# EAGLE design MegaSineShield (EAGLE 7.7.0)
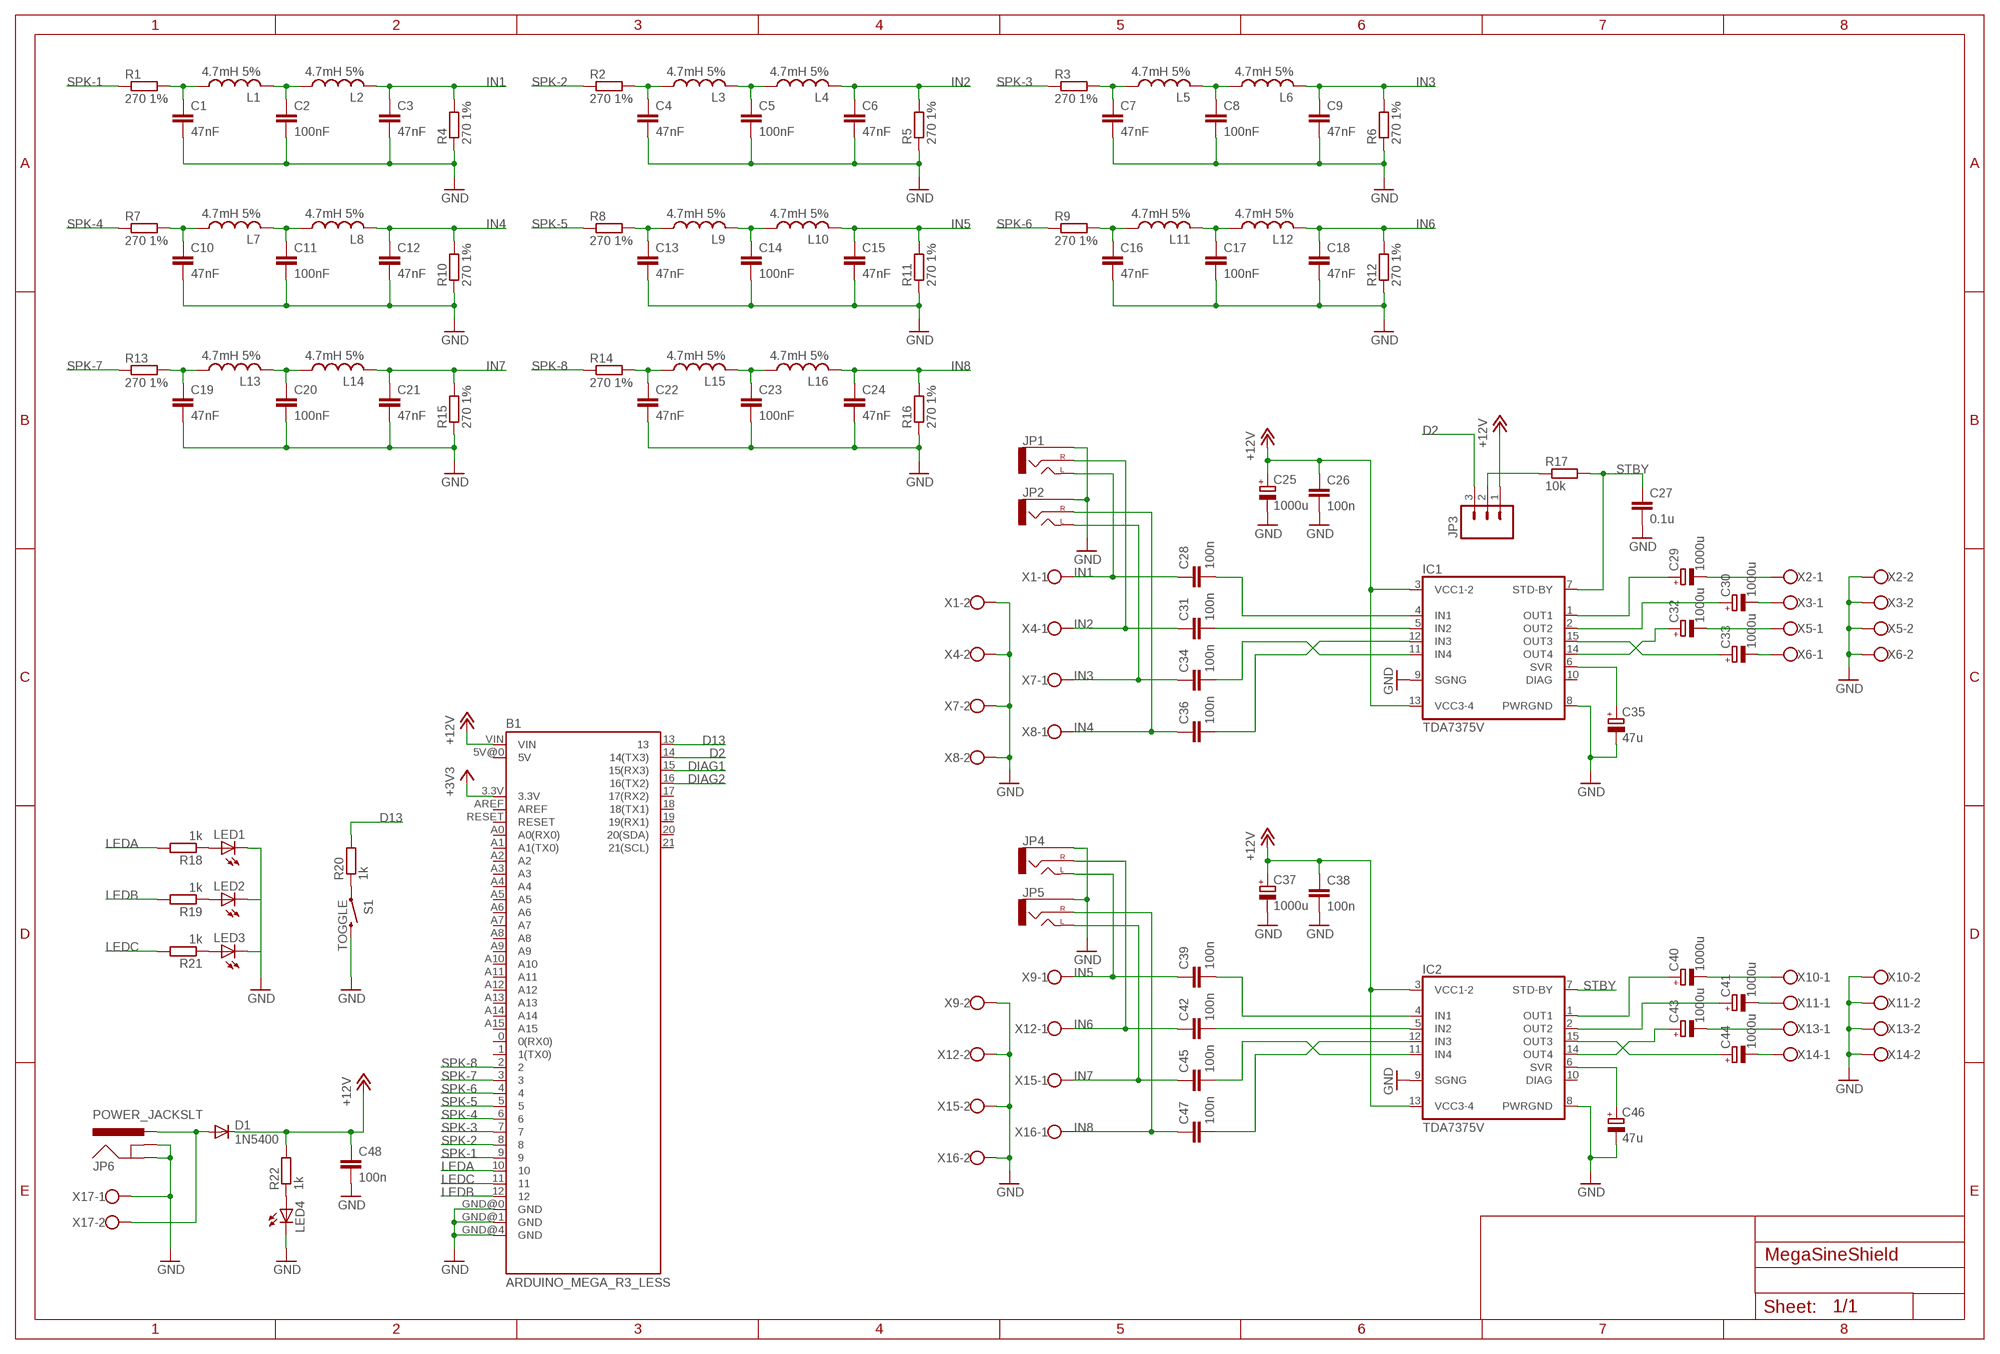
[diagram p0: schematic, sheet 1]

## Parts
B1  ARDUINO_MEGA_R3_LESS  [ARDUINO_MEGA_LESS]
C1  47nF  C-EU025-025X050  [C025-025X050]
C2  100nF  C-EU025-025X050  [C025-025X050]
C3  47nF  C-EU025-025X050  [C025-025X050]
C4  47nF  C-EU025-025X050  [C025-025X050]
C5  100nF  C-EU025-025X050  [C025-025X050]
C6  47nF  C-EU025-025X050  [C025-025X050]
C7  47nF  C-EU025-025X050  [C025-025X050]
C8  100nF  C-EU025-025X050  [C025-025X050]
C9  47nF  C-EU025-025X050  [C025-025X050]
C10  47nF  C-EU025-025X050  [C025-025X050]
C11  100nF  C-EU025-025X050  [C025-025X050]
C12  47nF  C-EU025-025X050  [C025-025X050]
C13  47nF  C-EU025-025X050  [C025-025X050]
C14  100nF  C-EU025-025X050  [C025-025X050]
C15  47nF  C-EU025-025X050  [C025-025X050]
C16  47nF  C-EU025-025X050  [C025-025X050]
C17  100nF  C-EU025-025X050  [C025-025X050]
C18  47nF  C-EU025-025X050  [C025-025X050]
C19  47nF  C-EU025-025X050  [C025-025X050]
C20  100nF  C-EU025-025X050  [C025-025X050]
C21  47nF  C-EU025-025X050  [C025-025X050]
C22  47nF  C-EU025-025X050  [C025-025X050]
C23  100nF  C-EU025-025X050  [C025-025X050]
C24  47nF  C-EU025-025X050  [C025-025X050]
C25  1000u  CPOL-EUE5-10.5  [E5-10,5]
C26  100n  C-EU025-025X050  [C025-025X050]
C27  0.1u  C-EU025-025X050  [C025-025X050]
C28  100n  C-EU025-025X050  [C025-025X050]
C29  1000u  CPOL-EUE5-10.5  [E5-10,5]
C30  1000u  CPOL-EUE5-10.5  [E5-10,5]
C31  100n  C-EU025-025X050  [C025-025X050]
C32  1000u  CPOL-EUE5-10.5  [E5-10,5]
C33  1000u  CPOL-EUE5-10.5  [E5-10,5]
C34  100n  C-EU025-025X050  [C025-025X050]
C35  47u  CPOL-EUE2.5-5  [E2,5-5]
C36  100n  C-EU025-025X050  [C025-025X050]
C37  1000u  CPOL-EUE5-10.5  [E5-10,5]
C38  100n  C-EU025-025X050  [C025-025X050]
C39  100n  C-EU025-025X050  [C025-025X050]
C40  1000u  CPOL-EUE5-10.5  [E5-10,5]
C41  1000u  CPOL-EUE5-10.5  [E5-10,5]
C42  100n  C-EU025-025X050  [C025-025X050]
C43  1000u  CPOL-EUE5-10.5  [E5-10,5]
C44  1000u  CPOL-EUE5-10.5  [E5-10,5]
C45  100n  C-EU025-025X050  [C025-025X050]
C46  47u  CPOL-EUE2.5-5  [E2,5-5]
C47  100n  C-EU025-025X050  [C025-025X050]
C48  100n  C-EU025-025X050  [C025-025X050]
D1  1N5400  [DO201-15]
IC1  TDA7375V  [MULTIWATT-15V]
IC2  TDA7375V  [MULTIWATT-15V]
JP1  AUDIO-JACKPTH  [AUDIO-JACK]
JP2  AUDIO-JACKPTH  [AUDIO-JACK]
JP3  M03LOCK  [1X03_LOCK]
JP4  AUDIO-JACKPTH  [AUDIO-JACK]
JP5  AUDIO-JACKPTH  [AUDIO-JACK]
JP6  POWER_JACKSLT  [POWER_JACK_SLOT]
L1  4.7mH 5%  L-US0207/2V  [0207/2V]
L2  4.7mH 5%  L-US0207/2V  [0207/2V]
L3  4.7mH 5%  L-US0207/2V  [0207/2V]
L4  4.7mH 5%  L-US0207/2V  [0207/2V]
L5  4.7mH 5%  L-US0207/2V  [0207/2V]
L6  4.7mH 5%  L-US0207/2V  [0207/2V]
L7  4.7mH 5%  L-US0207/2V  [0207/2V]
L8  4.7mH 5%  L-US0207/2V  [0207/2V]
L9  4.7mH 5%  L-US0207/2V  [0207/2V]
L10  4.7mH 5%  L-US0207/2V  [0207/2V]
L11  4.7mH 5%  L-US0207/2V  [0207/2V]
L12  4.7mH 5%  L-US0207/2V  [0207/2V]
L13  4.7mH 5%  L-US0207/2V  [0207/2V]
L14  4.7mH 5%  L-US0207/2V  [0207/2V]
L15  4.7mH 5%  L-US0207/2V  [0207/2V]
L16  4.7mH 5%  L-US0207/2V  [0207/2V]
LED1  LED5MM  [LED5MM]
LED2  LED5MM  [LED5MM]
LED3  LED5MM  [LED5MM]
LED4  LED5MM  [LED5MM]
R1  270 1%  R-EU_0207/2V  [0207/2V]
R2  270 1%  R-EU_0207/2V  [0207/2V]
R3  270 1%  R-EU_0207/2V  [0207/2V]
R4  270 1%  R-EU_0207/2V  [0207/2V]
R5  270 1%  R-EU_0207/2V  [0207/2V]
R6  270 1%  R-EU_0207/2V  [0207/2V]
R7  270 1%  R-EU_0207/2V  [0207/2V]
R8  270 1%  R-EU_0207/2V  [0207/2V]
R9  270 1%  R-EU_0207/2V  [0207/2V]
R10  270 1%  R-EU_0207/2V  [0207/2V]
R11  270 1%  R-EU_0207/2V  [0207/2V]
R12  270 1%  R-EU_0207/2V  [0207/2V]
R13  270 1%  R-EU_0207/2V  [0207/2V]
R14  270 1%  R-EU_0207/2V  [0207/2V]
R15  270 1%  R-EU_0207/2V  [0207/2V]
R16  270 1%  R-EU_0207/2V  [0207/2V]
R17  10k  R-EU_0207/2V  [0207/2V]
R18  1k  R-EU_0207/2V  [0207/2V]
R19  1k  R-EU_0207/2V  [0207/2V]
R20  1k  R-EU_0207/2V  [0207/2V]
R21  1k  R-EU_0207/2V  [0207/2V]
R22  1k  R-EU_0207/2V  [0207/2V]
S1  TOGGLE  SWITCH-MOMENTARY-2PTH  [TACTILE-PTH]
X1  W237-102  [W237-102]
X2  W237-102  [W237-102]
X3  W237-102  [W237-102]
X4  W237-102  [W237-102]
X5  W237-102  [W237-102]
X6  W237-102  [W237-102]
X7  W237-102  [W237-102]
X8  W237-102  [W237-102]
X9  W237-102  [W237-102]
X10  W237-102  [W237-102]
X11  W237-102  [W237-102]
X12  W237-102  [W237-102]
X13  W237-102  [W237-102]
X14  W237-102  [W237-102]
X15  W237-102  [W237-102]
X16  W237-102  [W237-102]
X17  W237-102  [W237-102]

## Nets
+3V3: B1.3.3V
+12V: B1.VIN C25.+ C26.1 C37.+ C38.1 C48.1 D1.C IC1.3(VCC1-2) IC1.13(VCC3-4) IC2.3(VCC1-2) IC2.13(VCC3-4) JP3.1 R22.2
D2: B1.14(14(TX3)) JP3.3
D13: B1.13 R20.2
DIAG1: B1.15(15(RX3))
DIAG2: B1.16(16(TX2))
GND: B1.GND@0(GND) B1.GND@1(GND) B1.GND@4(GND) C1.2 C2.2 C3.2 C4.2 C5.2 C6.2 C7.2 C8.2 C9.2 C10.2 C11.2 C12.2 C13.2 C14.2 C15.2 C16.2 C17.2 C18.2 C19.2 C20.2 C21.2 C22.2 C23.2 C24.2 C25.- C26.2 C27.2 C35.- C37.- C38.2 C46.- C48.2 IC1.8(PWRGND) IC1.9(SGNG) IC2.8(PWRGND) IC2.9(SGNG) JP1.SLEEVE JP2.SLEEVE JP4.SLEEVE JP5.SLEEVE JP6.GND@1(GNDBREAK) JP6.GND@2(GND) LED1.K(C) LED2.K(C) LED3.K(C) LED4.K(C) R4.1 R5.1 R6.1 R10.1 R11.1 R12.1 R15.1 R16.1 S1.3 X1.2 X2.2 X3.2 X4.2 X5.2 X6.2 X7.2 X8.2 X9.2 X10.2 X11.2 X12.2 X13.2 X14.2 X15.2 X16.2 X17.1
IN1: C3.1 C28.1 JP1.TIP(LEFT) L2.2 R4.2 X1.1
IN2: C6.1 C31.1 JP1.RING(RIGHT) L4.2 R5.2 X4.1
IN3: C9.1 C34.1 JP2.TIP(LEFT) L6.2 R6.2 X7.1
IN4: C12.1 C36.1 JP2.RING(RIGHT) L8.2 R10.2 X8.1
IN5: C15.1 C39.1 JP4.TIP(LEFT) L10.2 R11.2 X9.1
IN6: C18.1 C42.1 JP4.RING(RIGHT) L12.2 R12.2 X12.1
IN7: C21.1 C45.1 JP5.TIP(LEFT) L14.2 R15.2 X15.1
IN8: C24.1 C47.1 JP5.RING(RIGHT) L16.2 R16.2 X16.1
LEDA: B1.10 R18.2
LEDB: B1.12 R19.2
LEDC: B1.11 R21.2
N$1: C44.+ IC2.15(OUT3)
N$2: C32.+ IC1.14(OUT4)
N$3: C30.+ IC1.2(OUT2)
N$4: C29.+ IC1.1(OUT1)
N$9: C28.2 IC1.4(IN1)
N$10: C31.2 IC1.5(IN2)
N$11: C1.1 L1.1 R1.2
N$12: C36.2 IC1.12(IN3)
N$13: C35.+ IC1.6(SVR)
N$14: JP3.2 R17.1
N$15: C29.- X2.1
N$16: C30.- X3.1
N$17: C32.- X5.1
N$18: C33.- X6.1
N$19: LED4.A R22.1
N$24: C39.2 IC2.4(IN1)
N$25: C42.2 IC2.5(IN2)
N$26: C45.2 IC2.11(IN4)
N$27: C47.2 IC2.12(IN3)
N$28: C46.+ IC2.6(SVR)
N$29: C33.+ IC1.15(OUT3)
N$30: C43.+ IC2.14(OUT4)
N$31: C41.+ IC2.2(OUT2)
N$32: C40.+ IC2.1(OUT1)
N$33: C40.- X10.1
N$34: C41.- X11.1
N$35: C43.- X13.1
N$36: C44.- X14.1
N$37: LED1.A R18.1
N$38: LED2.A R19.1
N$39: R20.1 S1.1
N$41: LED3.A R21.1
N$45: D1.A JP6.PWR X17.2
N$46: C34.2 IC1.11(IN4)
N$47: C2.1 L1.2 L2.1
N$50: C10.1 L7.1 R7.2
N$51: C11.1 L7.2 L8.1
N$52: C19.1 L13.1 R13.2
N$53: C20.1 L13.2 L14.1
N$54: C22.1 L15.1 R14.2
N$55: C23.1 L15.2 L16.1
N$56: C4.1 L3.1 R2.2
N$57: C5.1 L3.2 L4.1
N$58: C13.1 L9.1 R8.2
N$59: C14.1 L9.2 L10.1
N$60: C7.1 L5.1 R3.2
N$61: C8.1 L5.2 L6.1
N$62: C16.1 L11.1 R9.2
N$63: C17.1 L11.2 L12.1
SPK-1: B1.9 R1.1
SPK-2: B1.8 R2.1
SPK-3: B1.7 R3.1
SPK-4: B1.6 R7.1
SPK-5: B1.5 R8.1
SPK-6: B1.4 R9.1
SPK-7: B1.3 R13.1
SPK-8: B1.2 R14.1
STBY: C27.1 IC1.7(STD-BY) IC2.7(STD-BY) R17.2
Unconnected: B1.0(0(RX0)) B1.1(1(TX0)) B1.5V@0(5V) B1.17(17(RX2)) B1.18(18(TX1)) B1.19(19(RX1)) B1.20(20(SDA)) B1.21(21(SCL)) B1.A0(A0(RX0)) B1.A1(A1(TX0)) B1.A2 B1.A3 B1.A4 B1.A5 B1.A6 B1.A7 B1.A8 B1.A9 B1.A10 B1.A11 B1.A12 B1.A13 B1.A14 B1.A15 B1.AREF B1.RESET IC1.10(DIAG) IC2.10(DIAG)

## Library data of the parts
B1 = SparkFun-Boards:ARDUINO_MEGA_R3_LESS
C1-C24 C26-C28 C31 C34 C36 C38 C39 C42 C45 C47 C48 = rcl:C-EU: CAPACITOR, European symbol
C25 C29 C30 C32 C33 C35 C37 C40 C41 C43 C44 C46 = rcl:CPOL-EU: POLARIZED CAPACITOR, European symbol
D1 = diode:1N5400: DIODE standard rectifier, 3 A, 50 V (Motorola)
IC1 IC2 = st-tda7375:TDA7375
JP1 JP2 JP4 JP5 = SparkFun-Connectors:AUDIO-JACK: 3.5mm Audio Jack Simple 3.5mm common PCB mount audio jack. Variant PTH is our storefront SKU PRT-08032
JP3 = SparkFun-Connectors:M03: Header 3 Standard 3-pin 0.1" header. Use with straight break away headers (SKU : PRT-00116), right angle break away headers (PRT-00553), swiss pins (PRT-00743), machine pins (PRT-00117), and female headers (PRT-00115). Molex polarized connector foot print use with SKU : PRT-08232 with associated crimp pins and housings.
JP6 = SparkFun-Connectors:POWER_JACK: Power Jack This is the standard 5.5mm barrel jack for power. The PTH is the most common, proven, reliable, footprint. The Slot footprint only works if the mill layer is transmitted to the PCB fab house so be warned. Mating wall wart : TOL-00298 (and others); PROD_ID: PRT-00119
L1-L16 = rcl:L-US: INDUCTOR, American symbol
LED1-LED4 = adafruit:LED: LED OSRAM: - CHIPLED LG R971, LG N971, LY N971, LG Q971, LY Q971, LO R971, LY R971 LH N974, LH R974 LS Q976, LO Q976, LY Q976 LO Q996 - Hyper CHIPLED LW Q18S LB Q993, LB Q99A, LB R99A - SideLED LS A670, LO A670, LY A670, LG A670, LP A670 LB A673, LV A673, LT A673, LW A673 LH A674 LY A675 LS A676, LA A676, LO A676, LY A676, LW A676 LS A679, LY A679, LG A679 - Hyper Micro SIDELED® LS Y876, LA Y876, LO Y876, LY Y876 LT Y87S - SmartLED LW L88C, LW L88S LB L89C, LB L89S, LG L890 LS L89K, LO L89K, LY L89K LS L896, LA L896, LO L896, LY L896 - TOPLED LS T670, LO T670, LY T670, LG T670, LP T670 LSG T670, LSP T670, LSY T670, LOP T670, LYG T670 LG T671, LOG T671, LSG T671 LB T673, LV T673, LT T673, LW T673 LH T674 LS T676, LA T676, LO T676, LY T676, LB T676, LH T676, LSB T676, LW T676 LB T67C, LV T67C, LT T67C, LS T67K, LO T67K, LY T67K, LW E67C LS E67B, LA E67B, LO E67B, LY E67B, LB E67C, LV E67C, LT E67C LW T67C LS T679, LY T679, LG T679 LS T770, LO T770, LY T770, LG T770, LP T770 LB T773, LV T773, LT T773, LW T773 LH T774 LS E675, LA E675, LY E675, LS T675 LS T776, LA T776, LO T776, LY T776, LB T776 LHGB T686 LT T68C, LB T68C - Hyper Mini TOPLED® LB M676 - Mini TOPLED Santana® LG M470 LS M47K, LO M47K, LY M47K Source: http://www.osram.convergy.de/
R1-R22 = rcl:R-EU_: RESISTOR, European symbol
S1 = SparkFun-Electromechanical:SWITCH-MOMENTARY-2: Various NO switches- pushbuttons, reed, etc; PROD_ID: SWCH-08441
X1-X17 = con-wago-500:W237-102: WAGO SCREW CLAMP; MPN: 237-102; OC_FARNELL: unknown; OC_NEWARK: 70K9898

## Board
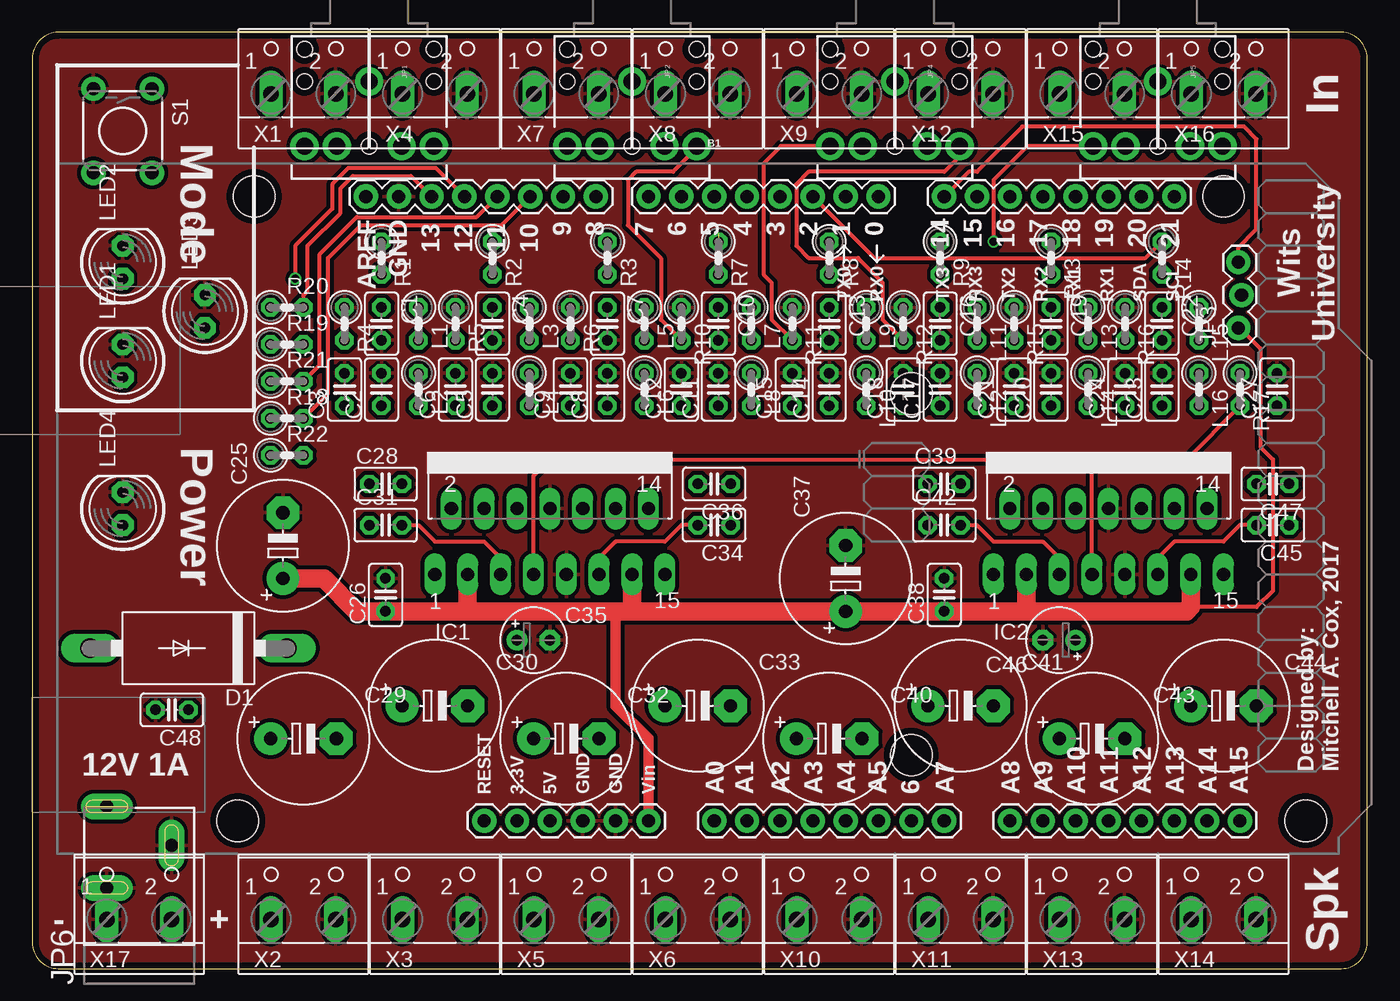
[diagram p1: board, top side]
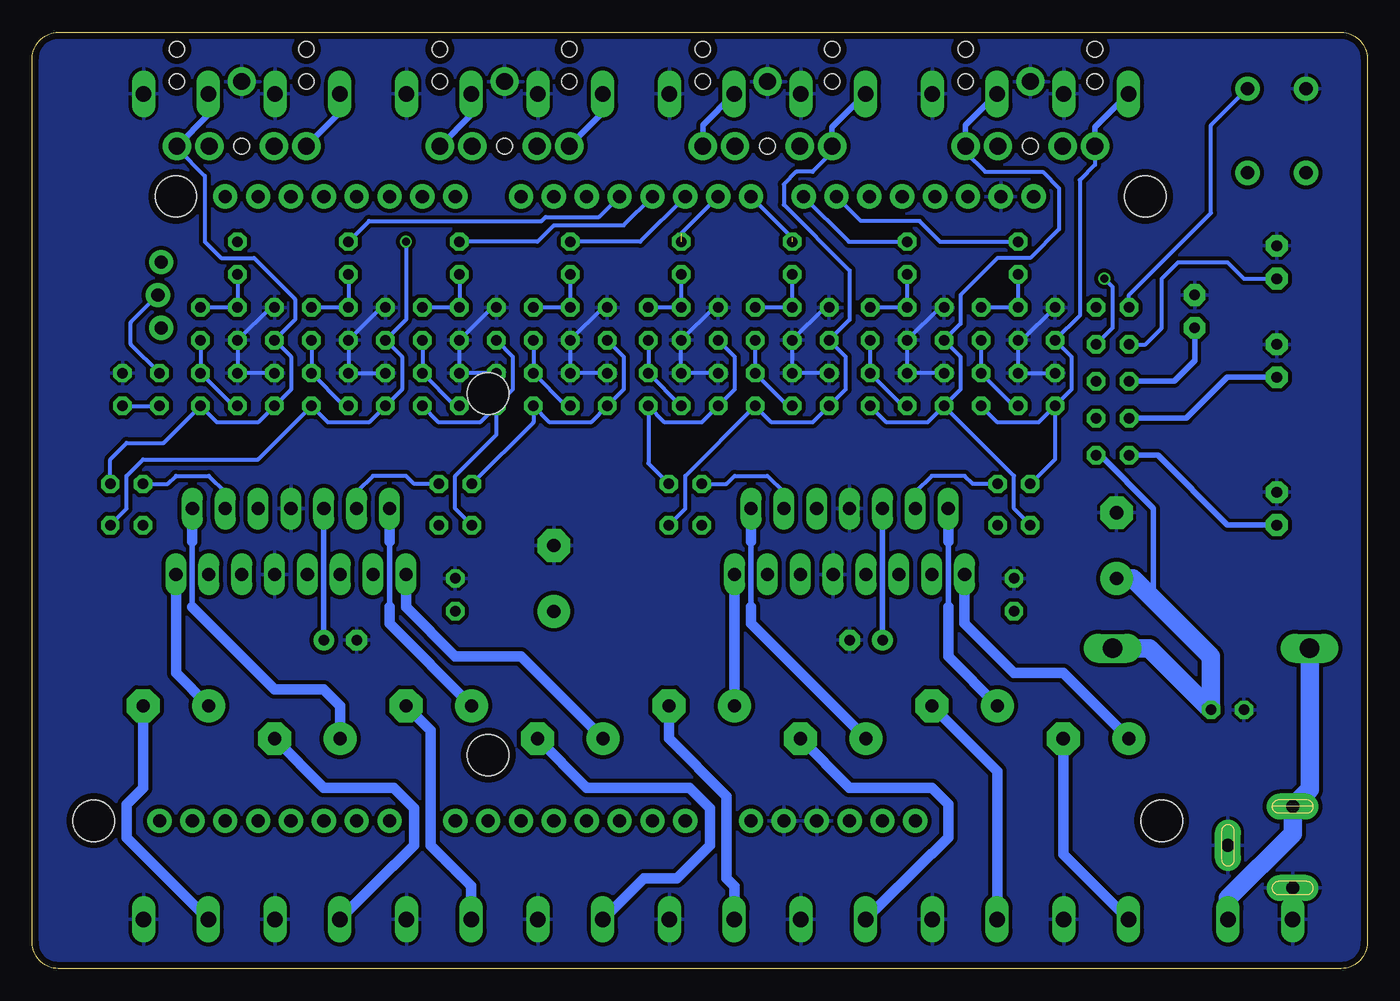
[diagram p2: board, bottom side, seen from below]

Size 103.17 x 72.38 mm. Coordinates in mm from the lower left corner, seen from the top.
Outline: 101.17,72.38 2,72.38 arc90 0,70.38 0,2 arc90 2,0 101.17,0 arc90 103.17,2 103.17,70.38 arc90 101.17,72.38
Copper layers (1*16): Top 0.035mm / dielectric 1.6mm / Bottom 0.035mm
Design rules "Elecrow_2-layer_PCB_eagle_rule *": minimum track width 6mil, minimum drill 12mil, track to track 12mil, track to pad 12mil, pad to pad 12mil, via to via 12mil, smd to smd 0mil, copper to edge 20mil, drill to drill 10mil, minimum pad ring 12mil, minimum via ring 6mil, stop-mask expansion 0mil, vias tented up to drill 100mil, thermal gap 10mil

### Footprints (pad centres in the part's own frame; a part is rotated, then mirrored left to right if it is on the bottom)
ARDUINO_MEGA_LESS = drill 1.016 pad 1.88: 0 13.97,24.13; 1 11.43,24.13; 2 8.89,24.13; 3 6.35,24.13; 3.3V -13.97,-24.13; 4 3.81,24.13; 5 1.27,24.13; 5V@0 -11.43,-24.13; 6 -1.27,24.13; 7 -3.81,24.13; 8 -7.874,24.13; 9 -10.414,24.13; 10 -12.954,24.13; 11 -15.494,24.13; 12 -18.034,24.13; 13 -20.574,24.13; 14 19.05,24.13; 15 21.59,24.13; 16 24.13,24.13; 17 26.67,24.13; 18 29.21,24.13; 19 31.75,24.13; 20 34.29,24.13; 21 36.83,24.13; A0 1.27,-24.13; A1 3.81,-24.13; A2 6.35,-24.13; A3 8.89,-24.13; A4 11.43,-24.13; A5 13.97,-24.13; A6 16.51,-24.13; A7 19.05,-24.13; A8 24.13,-24.13; A9 26.67,-24.13; A10 29.21,-24.13; A11 31.75,-24.13; A12 34.29,-24.13; A13 36.83,-24.13; A14 39.37,-24.13; A15 41.91,-24.13; AREF -25.654,24.13; GND@0 -8.89,-24.13; GND@1 -6.35,-24.13; GND@4 -23.114,24.13; RESET -16.51,-24.13; VIN -3.81,-24.13 | hole 3.2: -34.29,24.13; -35.56,-24.13; 16.51,8.89; 16.51,-19.05; 40.64,24.13; 46.99,-24.13
C025-025X050 = drill 0.813 octagon: 1 -1.27,0; 2 1.27,0
E5-10,5 = drill 1.016 pad 2.54: + -2.54,0 | drill 1.016 pad 2.54 octagon: - 2.54,0
E2,5-5 = drill 0.813 pad 1.6: + -1.27,0 | drill 0.813 pad 1.6 octagon: - 1.27,0
DO201-15 = drill 1.499 long: A 7.62,0; C -7.62,0
MULTIWATT-15V = drill 1.016 long: 1 -8.89,-7.62; 2 -7.62,-2.54; 3 -6.35,-7.62; 4 -5.08,-2.54; 5 -3.81,-7.62; 6 -2.54,-2.54; 7 -1.27,-7.62; 8 0,-2.54; 9 1.27,-7.62; 10 2.54,-2.54; 11 3.81,-7.62; 12 5.08,-2.54; 13 6.35,-7.62; 14 7.62,-2.54; 15 8.89,-7.62
AUDIO-JACK = drill 1.3 pad 2.184: RING 5,5; RSH 5,2.5; SLEEVE 0,0; TIP 5,-5; TSH 5,-2.5 | hole 1.2: 0,5; -2.5,5; -2.5,-5; 0,-5; 5,0
1X03_LOCK = drill 1.016 pad 1.88: 1 0,0.127; 2 2.54,-0.127; 3 5.08,0.127
POWER_JACK_SLOT = drill 1 pad 2 long: GND@1 2.58,7.5; GND@2 7.58,10.8; PWR 2.58,13.8
0207/2V = drill 0.813 octagon: 1 -1.27,0; 2 1.27,0
LED5MM = drill 0.813 pad 1.676 octagon: A -1.27,0; K 1.27,0
TACTILE-PTH = drill 1.016 pad 1.88: 1 -3.251,2.261; 2 3.251,2.261; 3 -3.251,-2.261; 4 3.251,-2.261
W237-102 = drill 1.194 long: 1 -2.5,-1.27; 2 2.5,-1.27

### Placement (x,y rotation side)
B1  51.44,35.56 0 top
C1  26.99,49.85 270 top
C2  26.99,44.77 90 top
C3  24.13,44.77 90 top
C4  35.56,49.85 270 top
C5  35.56,44.77 90 top
C6  32.7,44.77 90 top
C7  44.45,49.85 270 top
C8  44.45,44.77 90 top
C9  41.59,44.77 90 top
C10  53.02,49.85 270 top
C11  53.02,44.77 90 top
C12  50.16,44.77 90 top
C13  61.59,49.85 270 top
C14  61.59,44.77 90 top
C15  58.74,44.77 90 top
C16  70.17,49.85 270 top
C17  70.17,44.77 90 top
C18  67.31,44.77 90 top
C19  78.74,49.85 270 top
C20  78.74,44.77 90 top
C21  75.88,44.77 90 top
C22  87.31,49.85 270 top
C23  87.31,44.77 90 top
C24  84.45,44.77 90 top
C25  19.37,32.7 90 top
C26  27.3,28.89 90 top
C27  96.2,44.77 90 top
C28  27.3,37.47 0 top
C29  20.96,17.78 0 top
C30  31.12,20.32 0 top
C31  27.3,34.29 0 top
C32  41.27,17.78 0 top
C33  51.44,20.32 0 top
C34  52.7,34.29 180 top
C35  38.73,25.4 0 top
C36  52.7,37.47 180 top
C37  62.87,30.16 90 top
C38  70.48,28.89 90 top
C39  70.48,37.47 0 top
C40  61.59,17.78 0 top
C41  71.75,20.32 0 top
C42  70.48,34.29 0 top
C43  81.92,17.78 0 top
C44  92.08,20.32 0 top
C45  95.89,34.29 180 top
C46  79.38,25.4 180 top
C47  95.89,37.47 180 top
C48  10.79,20 180 top
D1  12.06,24.77 180 top
IC1  40.01,38.1 0 top
IC2  83.19,38.1 0 top
JP1  26.04,68.58 270 top
JP2  46.36,68.58 270 top
JP3  93.34,49.53 90 top
JP4  66.67,68.58 270 top
JP5  87,68.58 270 top
JP6  3.17,-1.27 0 top
L1  29.85,49.85 270 top
L2  29.85,44.77 270 top
L3  38.42,49.85 270 top
L4  38.42,44.77 270 top
L5  47.31,49.85 270 top
L6  47.31,44.77 270 top
L7  55.56,49.85 270 top
L8  55.56,44.77 270 top
L9  64.45,49.85 270 top
L10  64.45,44.77 270 top
L11  73.03,49.85 270 top
L12  73.03,44.77 270 top
L13  81.6,49.85 270 top
L14  81.6,44.77 270 top
L15  90.17,49.85 270 top
L16  90.17,44.77 270 top
LED1  6.99,46.99 90 top
LED2  6.99,54.61 90 top
LED3  13.33,50.8 90 top
LED4  6.99,35.56 90 top
R1  26.99,54.93 270 top
R2  35.56,54.93 270 top
R3  44.45,54.93 270 top
R4  24.13,49.85 270 top
R5  32.7,49.85 270 top
R6  41.59,49.85 270 top
R7  53.02,54.93 270 top
R8  61.59,54.93 270 top
R9  70.17,54.93 270 top
R10  50.16,49.85 270 top
R11  58.74,49.85 270 top
R12  67.31,49.85 270 top
R13  78.74,54.93 270 top
R14  87.31,54.93 270 top
R15  75.88,49.85 270 top
R16  84.45,49.85 270 top
R17  93.34,44.77 270 top
R18  19.69,42.55 0 top
R19  19.69,48.26 0 top
R20  19.69,51.12 0 top
R21  19.69,45.4 0 top
R22  19.69,39.69 0 top
S1  6.99,64.77 270 top
X1  20.96,68.9 0 top
X2  20.96,5.08 0 top
X3  31.12,5.08 0 top
X4  31.12,68.9 0 top
X5  41.27,5.08 0 top
X6  51.44,5.08 0 top
X7  41.27,68.9 0 top
X8  51.44,68.9 0 top
X9  61.59,68.9 0 top
X10  61.59,5.08 0 top
X11  71.75,5.08 0 top
X12  71.75,68.9 0 top
X13  81.92,5.08 0 top
X14  92.08,5.08 0 top
X15  81.92,68.9 0 top
X16  92.08,68.9 0 top
X17  8.25,5.08 0 top

### Tracks (layer width: path | path; a pad name or v marks a point on that pad's centre or on a via)
+12V
  Top 0.305: JP3.1 93.34,49.53 94.93,47.94 94.93,40.32 95.89,39.37 95.89,29.21 94.61,27.94 89.53,27.94
  Top 0.813: B1.VIN 47.62,17.78 45.09,20.32 45.09,27.62
  Top 1.422: 33.66,27.62 C26.1 25.08,27.62 22.54,30.16 C25.+ | 33.66,27.62 45.09,27.62 46.36,27.62 | 46.36,27.62 IC1.13 | IC1.3 33.66,27.62 | 46.36,27.62 C37.+ C38.1 76.84,27.62 | IC2.13 89.53,27.94 89.22,27.62 76.84,27.62 | IC2.3 76.84,27.62
  Bottom 0.406: R22.2 20.64,39.69 16.51,35.56 16.51,28.89 16.67,28.73
  Bottom 1.422: C25.+ 18.1,30.16 16.67,28.73 12.06,24.13 C48.1 16.83,24.77 D1.C
D2
  Top 0.305: JP3.3 93.22,55.75 94.61,57.15 94.61,64.14 93.66,65.09 76.52,65.09 73.03,61.59 72.39,61.59 B1.14
D13
  Top 0.305: R20.2 20.96,52.07 21.27,52.39 21.27,55.88 23.81,58.42 23.81,60.33 24.77,61.28 29.27,61.28 B1.13
GND
  Bottom 0.305: C3.2 C2.2 C1.2 26.67,48.58 R4.1 | C6.2 C5.2 C4.2 33.02,51.12 R5.1 | C9.2 C8.2 C7.2 41.91,51.12 R6.1 | C12.2 C11.2 C10.2 50.48,51.12 R10.1 | R11.1 59.05,51.12 C13.2 C14.2 C15.2 | C18.2 C17.2 C16.2 67.63,51.12 R12.1 | C21.2 C20.2 C19.2 76.2,51.12 R15.1 | C24.2 C23.2 C22.2 84.77,51.12 R16.1
  Bottom 1.422: X17.1 JP6.GND@1
  pour Bottom: 0,72.39 103.5,72.39 103.5,-1.27 0,0
  pour Top: -0.64,72.39 103.5,72.39 103.5,0 -0.64,-1.27
IN1
  Bottom 0.305: C3.1 22.86,44.77 22.86,47.31 R4.2 22.23,50.48 22.23,60.96 21.04,62.15 JP1.TIP | C3.1 25.4,42.23 28.58,42.23 L2.2 | C3.1 24.13,39.37 C28.1
  Bottom 0.406: JP1.TIP 21.04,65.05 X1.1
IN2
  Bottom 0.305: C6.1 31.43,44.77 31.43,47.31 R5.2 31.43,49.85 31.43,52.07 28.58,54.93 26.04,54.93 23.81,57.15 23.81,60.33 25.08,61.59 29.53,61.59 31.04,63.1 JP1.RING | C6.1 33.97,42.23 37.15,42.23 L4.2 | C31.1 27.3,35.56 27.3,38.1 C6.1
  Bottom 0.406: JP1.RING 31.04,65.21 X4.1
IN3
  Bottom 0.305: C34.1 52.7,35.56 52.7,38.1 L6.2 46.04,42.23 42.86,42.23 C9.1 40.32,44.77 40.32,47.31 R6.2 40.01,50.16 40.01,53.98 45.09,59.05 45.09,60.64 44.13,61.59 42.86,61.59 41.36,63.1 JP2.TIP
  Bottom 0.406: JP2.TIP 41.36,65.05 X7.1
IN4
  Top 0.305: JP2.RING 51.36,63.42 49.53,61.59 46.67,61.59 46.04,60.96 46.04,57.47 48.58,54.93 48.58,50.16 R10.2
  Bottom 0.305: R10.2 48.9,47.31 48.9,44.77 C12.1 51.44,42.23 54.29,42.23 L8.2 55.56,39.05 C36.1
  Bottom 0.406: JP2.RING 51.36,65.21 X8.1
IN5
  Top 0.305: JP4.TIP 57.87,63.58 56.52,62.23 56.52,53.66 57.15,53.02 57.15,50.16 R11.2
  Bottom 0.305: R11.2 57.47,47.31 57.47,44.77 C15.1 60.01,42.23 63.18,42.23 L10.2 64.45,42.23 C39.1
  Bottom 0.406: X9.1 59.09,66.16 JP4.TIP
IN6
  Top 0.305: JP4.RING 71.67,62.78 70.48,61.59 60.01,61.59 59.05,60.64 59.05,55.88 60.01,54.93 63.82,54.93 65.72,53.02 65.72,50.16 R12.2
  Bottom 0.305: R12.2 66.04,47.31 66.04,44.77 C18.1 | C18.1 68.58,42.23 71.75,42.23 L12.2 | C42.1 70.48,35.56 70.48,38.1 67.31,41.27 C18.1
  Bottom 0.406: X12.1 69.25,66 JP4.RING
IN7  (via drill 0.6)
  Top 0.305: JP5.TIP 76.92,63.58 74.3,60.96 v74.3,56.2
  Bottom 0.305: C45.1 95.89,35.56 95.89,38.1 94.61,39.37 85.72,39.37 L14.2 80.33,42.23 77.15,42.23 C21.1 74.61,44.77 74.61,47.31 R15.2 74.3,50.16 v74.3,56.2
  Bottom 0.406: X15.1 79.42,66.16 JP5.TIP
IN8
  Bottom 0.305: C47.1 97.16,39.37 95.89,40.64 93.03,40.64 L16.2 88.9,42.23 85.72,42.23 C24.1 83.19,44.77 83.19,47.31 R16.2 82.87,50.16 82.87,51.75 86.04,54.93 88.58,54.93 89.85,56.2 89.85,61.28 92,63.42 JP5.RING
  Bottom 0.406: X16.1 89.58,66 JP5.RING
LEDA
  Top 0.305: R18.2 22.86,44.45 22.86,54.93 25.4,57.47 36.26,57.47 B1.10
LEDB  (via drill 0.6)
  Top 0.305: B1.12 31.18,61.91 24.45,61.91 23.18,60.64 23.18,58.74 20.32,55.88 v20.32,53.34
  Bottom 0.305: R19.2 19.69,49.53 19.69,52.7 v20.32,53.34
LEDC
  Top 0.305: B1.11 34.35,58.1 25.08,58.1 22.23,55.24 22.23,46.67 R21.2
N$1
  Bottom 0.813: IC2.15 92.08,22.86 C44.+
N$2
  Bottom 0.406: 47.62,33.02 47.62,27.94
  Bottom 0.813: IC1.14 47.62,33.02 | 47.62,27.94 47.62,26.67 C32.+
N$3
  Bottom 0.406: 32.38,33.02 32.38,27.94
  Bottom 0.813: IC1.2 32.38,33.02 | C30.+ 32.38,24.13 32.38,27.94
N$4
  Bottom 0.813: IC1.1 31.12,26.67 27.3,22.86 23.5,22.86 C29.+
N$9
  Bottom 0.305: C28.2 30.48,37.47 31.12,38.1 33.66,38.1 34.93,36.83 IC1.4
N$10
  Top 0.305: C31.2 29.85,34.29 31.12,33.02 34.93,33.02 36.2,31.75 IC1.5
N$11
  Bottom 0.305: R1.2 C1.1 L1.1
N$12
  Bottom 0.305: C36.2 49.53,37.47 48.9,38.1 46.36,38.1 45.09,36.83 IC1.12
N$13
  Bottom 0.406: IC1.6 C35.+
N$14
  Bottom 0.305: R17.1 95.57,48.26 95.57,49.97 JP3.2
N$15
  Bottom 0.813: C29.- 23.5,8.85 X2.1
N$16  (via drill 0.6)
  Top 0.61: v28.58,3.85 X3.1
  Bottom 0.813: v28.58,3.85 28.58,15.24 C30.-
N$17
  Bottom 0.813: C32.- 40.01,13.97 33.66,13.97 32.38,12.7 32.38,10.16 33.66,8.89 33.7,8.89 X5.1
N$18
  Bottom 0.813: C33.- 53.98,17.78 49.53,13.34 49.53,6.99 48.9,6.35 48.9,3.85 X6.1
N$19
  Bottom 0.406: R22.1 16.19,39.69 10.79,34.29 LED4.A
N$24
  Bottom 0.305: C39.2 73.66,37.47 74.3,38.1 76.84,38.1 78.11,36.83 IC2.4
N$25
  Top 0.305: C42.2 73.03,34.29 74.3,33.02 78.11,33.02 79.38,31.75 IC2.5
N$26
  Top 0.305: C45.2 93.34,34.29 92.08,33.02 88.27,33.02 87,31.75 IC2.11
N$27
  Bottom 0.305: C47.2 92.71,37.47 92.08,38.1 89.53,38.1 88.27,36.83 IC2.12
N$28
  Bottom 0.406: IC2.6 C46.+
N$29
  Bottom 0.813: IC1.15 C33.+
N$30
  Bottom 0.406: 90.81,33.02 90.81,27.94
  Bottom 0.813: IC2.14 90.81,33.02 | 90.81,27.94 84.45,21.59 80.64,21.59 79.38,20.32 C43.+
N$31
  Bottom 0.406: 75.56,33.02 75.56,27.94
  Bottom 0.813: IC2.2 75.56,33.02 | 75.56,27.94 75.56,26.67 C41.+
N$32
  Bottom 0.813: IC2.1 74.3,27.94 70.48,24.13 65.41,24.13 C40.+
N$33
  Bottom 0.813: C40.- 60.33,13.97 52.39,13.97 50.8,12.38 50.8,9.53 53.34,6.99 55.88,6.99 59.05,3.81 X10.1
N$34
  Bottom 0.813: C41.- 72.39,18.41 72.39,9.53 69.25,6.39 X11.1
N$35
  Bottom 0.813: C43.- 80.64,13.97 75.25,13.97 73.66,12.38 73.66,9.53 75.25,7.94 75.25,7.98 X13.1
N$36
  Bottom 0.813: C44.- 94.61,13.97 95.89,12.7 95.89,10.12 X14.1
N$37
  Bottom 0.406: R18.1 13.97,42.55 10.79,45.72 LED1.A
N$38
  Bottom 0.305: R19.1 17.14,48.26 15.88,49.53 15.88,53.34 14.6,54.61 10.79,54.61 9.53,53.34 LED2.A
N$39
  Bottom 0.305: R20.1 18.42,52.07 12.06,58.42 12.06,65.2 S1.1
N$41
  Bottom 0.406: R21.1 14.92,45.4 13.33,46.99 LED3.A
N$45
  Bottom 1.422: X17.2 10.75,5.44 5.75,10.44 JP6.PWR 4.45,13.84 D1.A
N$46
  Top 0.305: C34.2 50.16,34.29 48.9,33.02 45.09,33.02 43.81,31.75 IC1.11
N$47
  Bottom 0.305: L1.2 L2.1 27.3,43.5 C2.1
N$50
  Bottom 0.305: R7.2 C10.1 L7.1
N$51
  Bottom 0.305: L7.2 L8.1 C11.1
N$52
  Bottom 0.305: R13.2 C19.1 L13.1
N$53
  Bottom 0.305: L13.2 L14.1 79.06,43.5 C20.1
N$54
  Bottom 0.305: R14.2 C22.1 L15.1
N$55
  Bottom 0.305: L15.2 L16.1 87.63,43.5 C23.1
N$56
  Bottom 0.305: R2.2 C4.1 L3.1
N$57
  Bottom 0.305: L3.2 L4.1 35.88,43.5 C5.1
N$58
  Bottom 0.305: R8.2 C13.1 L9.1
N$59
  Bottom 0.305: L9.2 L10.1 61.91,43.5 C14.1
N$60
  Bottom 0.305: R3.2 C7.1 L5.1
N$61
  Bottom 0.305: L5.2 L6.1 44.77,43.5 C8.1
N$62
  Bottom 0.305: R9.2 C16.1 L11.1
N$63
  Bottom 0.305: L11.2 L12.1 70.48,43.5 C17.1
SPK-1
  Bottom 0.305: B1.9 39.12,57.78 34.61,57.78 33.02,56.2 R1.1
SPK-2
  Bottom 0.305: B1.8 40.07,56.2 R2.1
SPK-3  (1 unrouted)
  Bottom 0.305: 44.45,56.52 B1.7
SPK-4  (1 unrouted)
  Bottom 0.305: 53.02,56.83 B1.6
SPK-5
  Bottom 0.305: B1.5 56.2,56.2 R8.1
SPK-6
  Bottom 0.305: B1.4 57.47,57.47 62.87,57.47 64.13,56.2 R9.1
SPK-7
  Bottom 0.305: B1.3 59.37,58.1 63.5,58.1 63.82,57.78 77.15,57.78 R13.1
SPK-8
  Top 0.305: B1.2 65.09,54.93 86.04,54.93 R14.1
STBY
  Top 0.305: IC2.7 81.92,39.37 | 81.92,39.37 89.22,39.37 R17.2 | IC1.7 38.73,38.1 40.01,39.37 81.92,39.37
  Bottom 0.305: C27.1 R17.2

### Text on the board
tSilk: In | Mode | Wits / University | Power | 12V 1A | Designed by: / Mitchell A. Cox, 2017 | - | + | Spk